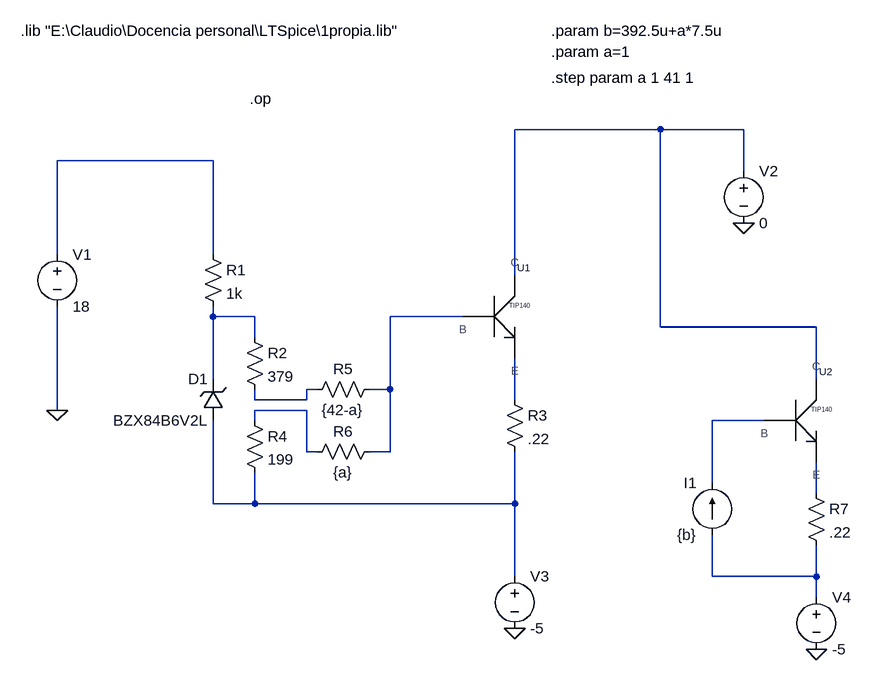
[diagram p0: schematic cargavariable.asc]
cargavariable.asc, the LTspice schematic file:
Version 4
SHEET 1 1316 680
WIRE 864 -144 640 -144
WIRE 992 -144 864 -144
WIRE 176 -96 -64 -96
WIRE 992 -80 992 -144
WIRE -64 48 -64 -96
WIRE 176 48 176 -96
WIRE 640 80 640 -144
WIRE 176 144 176 128
WIRE 240 144 176 144
WIRE 560 144 448 144
WIRE 864 160 864 -144
WIRE 1104 160 864 160
WIRE 240 176 240 144
WIRE 176 240 176 144
WIRE 1104 240 1104 160
WIRE 336 256 320 256
WIRE 448 256 448 144
WIRE 448 256 416 256
WIRE 240 272 240 256
WIRE 320 272 320 256
WIRE 320 272 240 272
WIRE 640 272 640 208
WIRE -64 288 -64 128
WIRE 320 288 240 288
WIRE 240 304 240 288
WIRE 1024 304 944 304
WIRE 320 352 320 288
WIRE 336 352 320 352
WIRE 448 352 448 256
WIRE 448 352 416 352
WIRE 944 400 944 304
WIRE 1104 416 1104 368
WIRE 176 432 176 304
WIRE 240 432 240 384
WIRE 240 432 176 432
WIRE 640 432 640 352
WIRE 640 432 240 432
WIRE 640 544 640 432
WIRE 944 544 944 480
WIRE 1104 544 1104 496
WIRE 1104 544 944 544
WIRE 1104 576 1104 544
FLAG -64 288 0
FLAG 992 0 0
FLAG 640 624 0
FLAG 1104 656 0
SYMBOL voltage -64 32 R0
WINDOW 123 0 0 Left 0
WINDOW 39 0 0 Left 0
SYMATTR InstName V1
SYMATTR Value 18
SYMBOL voltage 992 -96 R0
WINDOW 123 0 0 Left 0
WINDOW 39 0 0 Left 0
SYMATTR InstName V2
SYMATTR Value 0
SYMBOL res 624 256 R0
SYMATTR InstName R3
SYMATTR Value .22
SYMBOL voltage 640 528 R0
WINDOW 123 0 0 Left 0
WINDOW 39 0 0 Left 0
SYMATTR InstName V3
SYMATTR Value -5
SYMBOL zener 192 304 R180
WINDOW 0 24 64 Left 2
WINDOW 3 24 0 Left 2
SYMATTR InstName D1
SYMATTR Value BZX84B6V2L
SYMBOL res 160 32 R0
SYMATTR InstName R1
SYMATTR Value 1k
SYMBOL res 224 160 R0
SYMATTR InstName R2
SYMATTR Value 379
SYMBOL res 224 288 R0
SYMATTR InstName R4
SYMATTR Value 199
SYMBOL Propia\\Darlington\ npn 608 144 R0
SYMATTR Value TIP140
SYMATTR InstName U1
SYMBOL res 432 240 R90
WINDOW 0 0 56 VBottom 2
WINDOW 3 32 56 VTop 2
SYMATTR InstName R5
SYMATTR Value {42-a}
SYMBOL res 432 336 R90
WINDOW 0 0 56 VBottom 2
WINDOW 3 32 56 VTop 2
SYMATTR InstName R6
SYMATTR Value {a}
SYMBOL Propia\\Darlington\ npn 1072 304 R0
SYMATTR Value TIP140
SYMATTR InstName U2
SYMBOL res 1088 400 R0
SYMATTR InstName R7
SYMATTR Value .22
SYMBOL current 944 480 R180
WINDOW 0 24 80 Left 2
WINDOW 3 24 0 Left 2
WINDOW 123 0 0 Left 0
WINDOW 39 0 0 Left 0
SYMATTR InstName I1
SYMATTR Value {b}
SYMBOL voltage 1104 560 R0
WINDOW 123 0 0 Left 0
WINDOW 39 0 0 Left 0
SYMATTR InstName V4
SYMATTR Value -5
TEXT -120 -296 Left 2 !.lib "E:\\Claudio\\Docencia personal\\LTSpice\\1propia.lib"
TEXT 232 -192 Left 2 !.op
TEXT 696 -264 Left 2 !.param a=1
TEXT 696 -224 Left 2 !.step param a 1 41 1
TEXT 696 -296 Left 2 !.param b=392.5u+a*7.5u

The netlist it stands for:
* cargavariable.asc
V1 N002 0 18
V2 N001 0 0
R3 N006 N010 .22
V3 N010 0 -5
D1 N010 N003 BZX84B6V2L
R1 N002 N003 1k
R2 N003 N005 379
R4 N007 N010 199
XU1 N001 N004 N006 TIP140  ; pins C B E
R5 N004 N005 {42-a}
R6 N004 N007 {a}
XU2 N001 N008 N009 TIP140  ; pins C B E
R7 N009 N011 .22
I1 N011 N008 {b}
V4 N011 0 -5
.model D D
.lib standard.dio
.lib "E:\Claudio\Docencia personal\LTSpice\1propia.lib"
.op
.param a=1
.step param a 1 41 1
.param b=392.5u+a*7.5u
.backanno
.end